# Altium project PCB_Project.PrjPcb
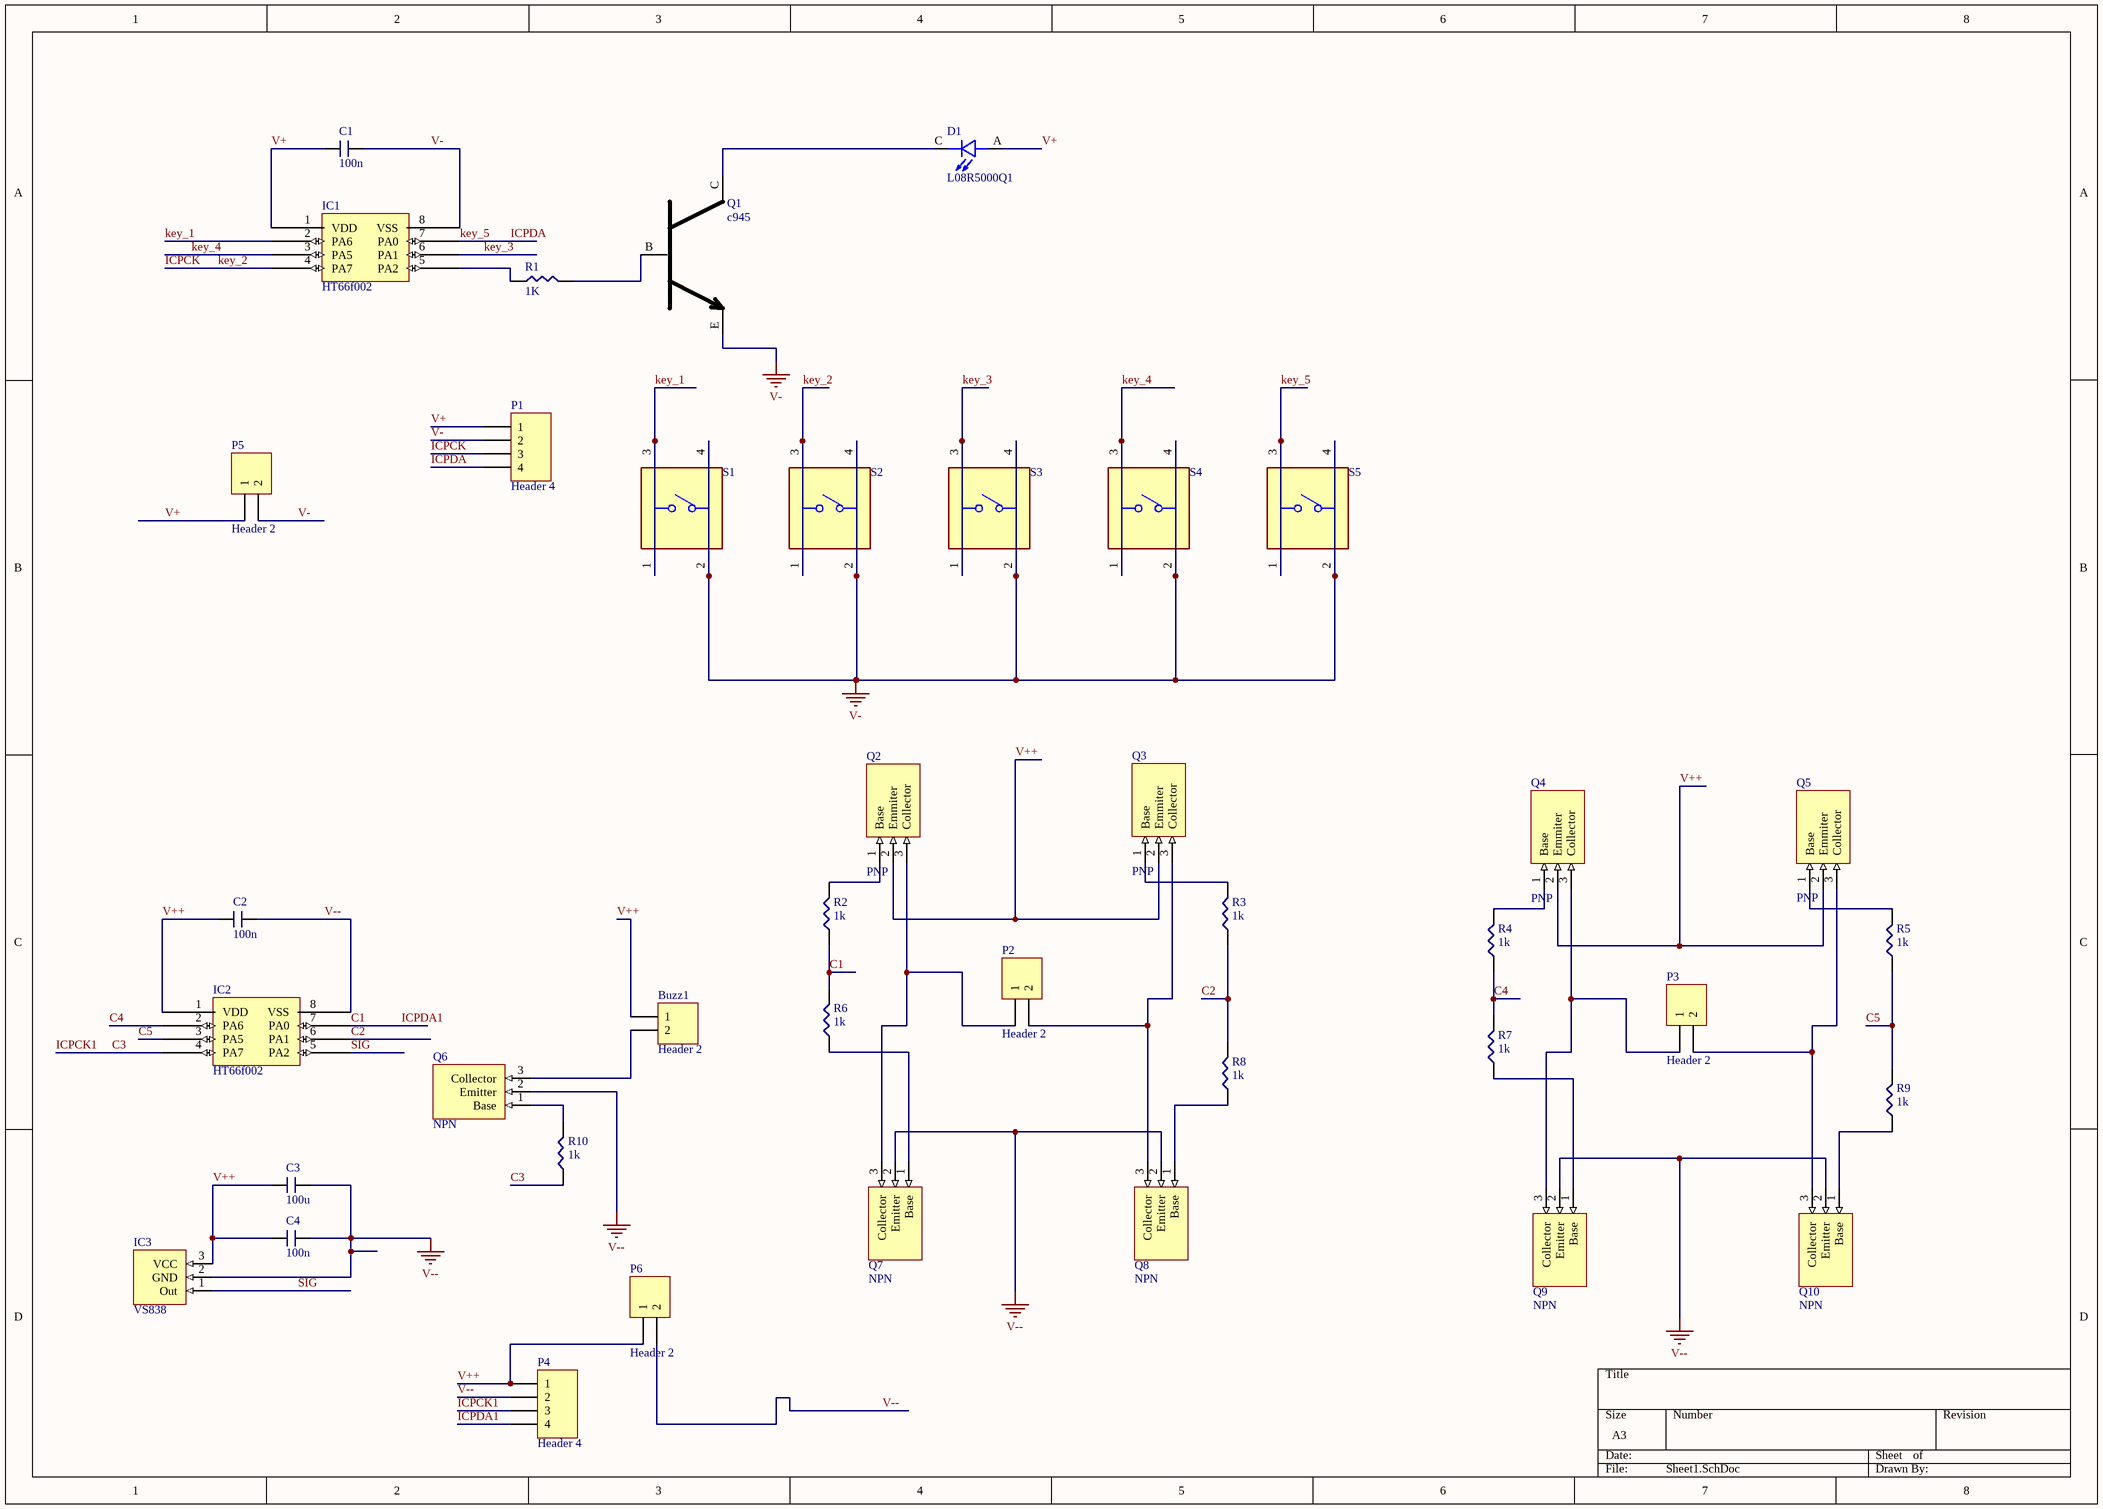
[diagram p0: Sheet1.SchDoc]
1 sheet, 40 parts. Net scope: global (net labels, ports and power ports of the same name join across sheets).
Board files: PCB1.PcbDoc, PCB2.PcbDoc

## Sheet Sheet1.SchDoc
size A3

### Parts
Buzz1  Header 2  [HDR1X2]
C1  value 100n  [CAPC2012X08N-805]  (hidden comment: Capacitor)
C2  value 100n  [CAPC2012X08N-805]  (hidden comment: Capacitor)
C3  value 100u  [CAPC2012X08N-805]  (hidden comment: Capacitor)
C4  value 100n  [CAPC2012X08N-805]  (hidden comment: Capacitor)
D1  L08R5000Q1  [LEDRD254W57D500H1070]
IC1  HT66f002  [ht66f002]
IC2  HT66f002  [ht66f002]
IC3  VS838  [VS838]
P1  Header 4  [HDR1X4]
P2  Header 2  [HDR1X2]
P3  Header 2  [HDR1X2]
P4  Header 4  [HDR1X4]
P5  Header 2  [HDR1X2]
P6  Header 2  [HDR1X2]
Q1  c945  [c945]
Q2  PNP  [pmbt8550]
Q3  PNP  [pmbt8550]
Q4  PNP  [pmbt8550]
Q5  PNP  [pmbt8550]
Q6  NPN  [MMBT8050]
Q7  NPN  [MMBT8050]
Q8  NPN  [MMBT8050]
Q9  NPN  [MMBT8050]
Q10  NPN  [MMBT8050]
R1  value 1K  [RESC2012X06N-805]  (hidden comment: Resistor)
R2  value 1k  [RESC2012X06N-805]  (hidden comment: Resistor)
R3  value 1k  [RESC2012X06N-805]  (hidden comment: Resistor)
R4  value 1k  [RESC2012X06N-805]  (hidden comment: Resistor)
R5  value 1k  [RESC2012X06N-805]  (hidden comment: Resistor)
R6  value 1k  [RESC2012X06N-805]  (hidden comment: Resistor)
R7  value 1k  [RESC2012X06N-805]  (hidden comment: Resistor)
R8  value 1k  [RESC2012X06N-805]  (hidden comment: Resistor)
R9  value 1k  [RESC2012X06N-805]  (hidden comment: Resistor)
R10  value 1k  [RESC2012X06N-805]  (hidden comment: Resistor)
S1  TS04-66-95-BK-100-SMT  [SW_TS04-66-95-BK-100-SMT]  (value not drawn)
S2  TS04-66-95-BK-100-SMT  [SW_TS04-66-95-BK-100-SMT]  (value not drawn)
S3  TS04-66-95-BK-100-SMT  [SW_TS04-66-95-BK-100-SMT]  (value not drawn)
S4  TS04-66-95-BK-100-SMT  [SW_TS04-66-95-BK-100-SMT]  (value not drawn)
S5  TS04-66-95-BK-100-SMT  [SW_TS04-66-95-BK-100-SMT]  (value not drawn)

### Nets
V-: C1.2 IC1.8(VSS) P1.2 P5.2 Q1.E S1.2 S1.4 S2.2 S2.4 S3.2 S3.4 S4.2 S4.4 S5.2 S5.4
V--: C2.2 C3.2 C4.2 IC2.8(VSS) IC3.2(GND) P4.2 P6.2 Q6.2(Emitter) Q7.2(Emitter) Q8.2(Emitter) Q9.2(Emitter) Q10.2(Emitter)
C1: IC2.7(PA0) P4.4 R2.1 R6.2  [also labelled ICPDA1]
C2: IC2.6(PA1) R3.1 R8.2
C3: IC2.4(PA7) P4.3 R10.1  [also labelled ICPCK1]
C4: IC2.2(PA6) R4.1 R7.2
C5: IC2.3(PA5) R5.1 R9.2
ICPCK: IC1.4(PA7) P1.3 S2.1 S2.3  [also labelled key_2]
ICPDA: IC1.7(PA0) P1.4 S5.1 S5.3  [also labelled key_5]
key_1: IC1.2(PA6) S1.1 S1.3
key_3: IC1.6(PA1) S3.1 S3.3
key_4: IC1.3(PA5) S4.1 S4.3
SIG: IC2.5(PA2) IC3.1(Out)
V+: C1.1 D1.A IC1.1(VDD) P1.1 P5.1
V++: Buzz1.1 C2.1 C3.1 C4.1 IC2.1(VDD) IC3.3(VCC) P4.1 P6.1 Q2.2(Emmiter) Q3.2(Emmiter) Q4.2(Emmiter) Q5.2(Emmiter)
NetBuzz1_2: Buzz1.2 Q6.3(Collector)
NetD1_C: D1.C Q1.C
NetIC1_5: IC1.5(PA2) R1.1
NetP2_1: P2.1 Q2.3(Collector) Q7.3(Collector)
NetP2_2: P2.2 Q3.3(Collector) Q8.3(Collector)
NetP3_1: P3.1 Q4.3(Collector) Q9.3(Collector)
NetP3_2: P3.2 Q5.3(Collector) Q10.3(Collector)
NetQ1_B: Q1.B R1.2
NetQ2_1: Q2.1(Base) R2.2
NetQ3_1: Q3.1(Base) R3.2
NetQ4_1: Q4.1(Base) R4.2
NetQ5_1: Q5.1(Base) R5.2
NetQ6_1: Q6.1(Base) R10.2
NetQ7_1: Q7.1(Base) R6.1
NetQ8_1: Q8.1(Base) R8.1
NetQ9_1: Q9.1(Base) R7.1
NetQ10_1: Q10.1(Base) R9.1

### Library data of the parts
Buzz1 P2 P3 P5 P6 = Header 2: Header, 2-Pin; LatestRevisionDate: 17-Jul-2002; LatestRevisionNote: Re-released for DXP Platform.; Publisher: Altium Limited
C1-C4 = Capacitor: Standard Bipolar Capasitor
D1 = L08R5000Q1: LED, Orange, Through Hole, T-1 3/4 (5mm), 30 mA, 2.1 V, 635 nm; Price: None; MP: L08R5000Q1; Value: *; Availability: Unavailable; Package: None
P1 P4 = Header 4: Header, 4-Pin; LatestRevisionDate: 17-Jul-2002; LatestRevisionNote: Re-released for DXP Platform.; Publisher: Altium Limited
Q2-Q5 = pmbt8550
Q6-Q10 = MMBT8050
R1-R10 = Resistor: Standard Resistor
S1-S5 = TS04-66-95-BK-100-SMT: 6 x 6 mm, 4.3~9.5 mm Actuator Height, 100~260 gf, Surface Mount, SPST, Tactile Switch; MF: CUI Devices; Package: None; Price: None; SnapEDA_Link: https://www.snapeda.com/parts/TS04-66-95-BK-100-SMT/CUI+Devices/view-part/?ref=snap; CUI_purchase_URL: https://www.cuidevices.com/product/switches/tactile-switches/ts04-series?utm_source=snapeda.com&utm_medium=referral&utm_campaign=snapedaBOM; Value: *; Check_prices: https://www.snapeda.com/parts/TS04-66-95-BK-100-SMT/CUI+Devices/view-part/?ref=eda; MP: TS04-66-95-BK-100-SMT; Purchase-URL: https://pricing.snapeda.com/search/part/TS04-66-95-BK-100-SMT/?ref=eda; Availability: In Stock